# Altium schematic sheet Weatstone bridges part II.SchDoc: Weatstone bridges part II
size A4; Revision: 1; SheetNumber: 5; SheetTotal: 5
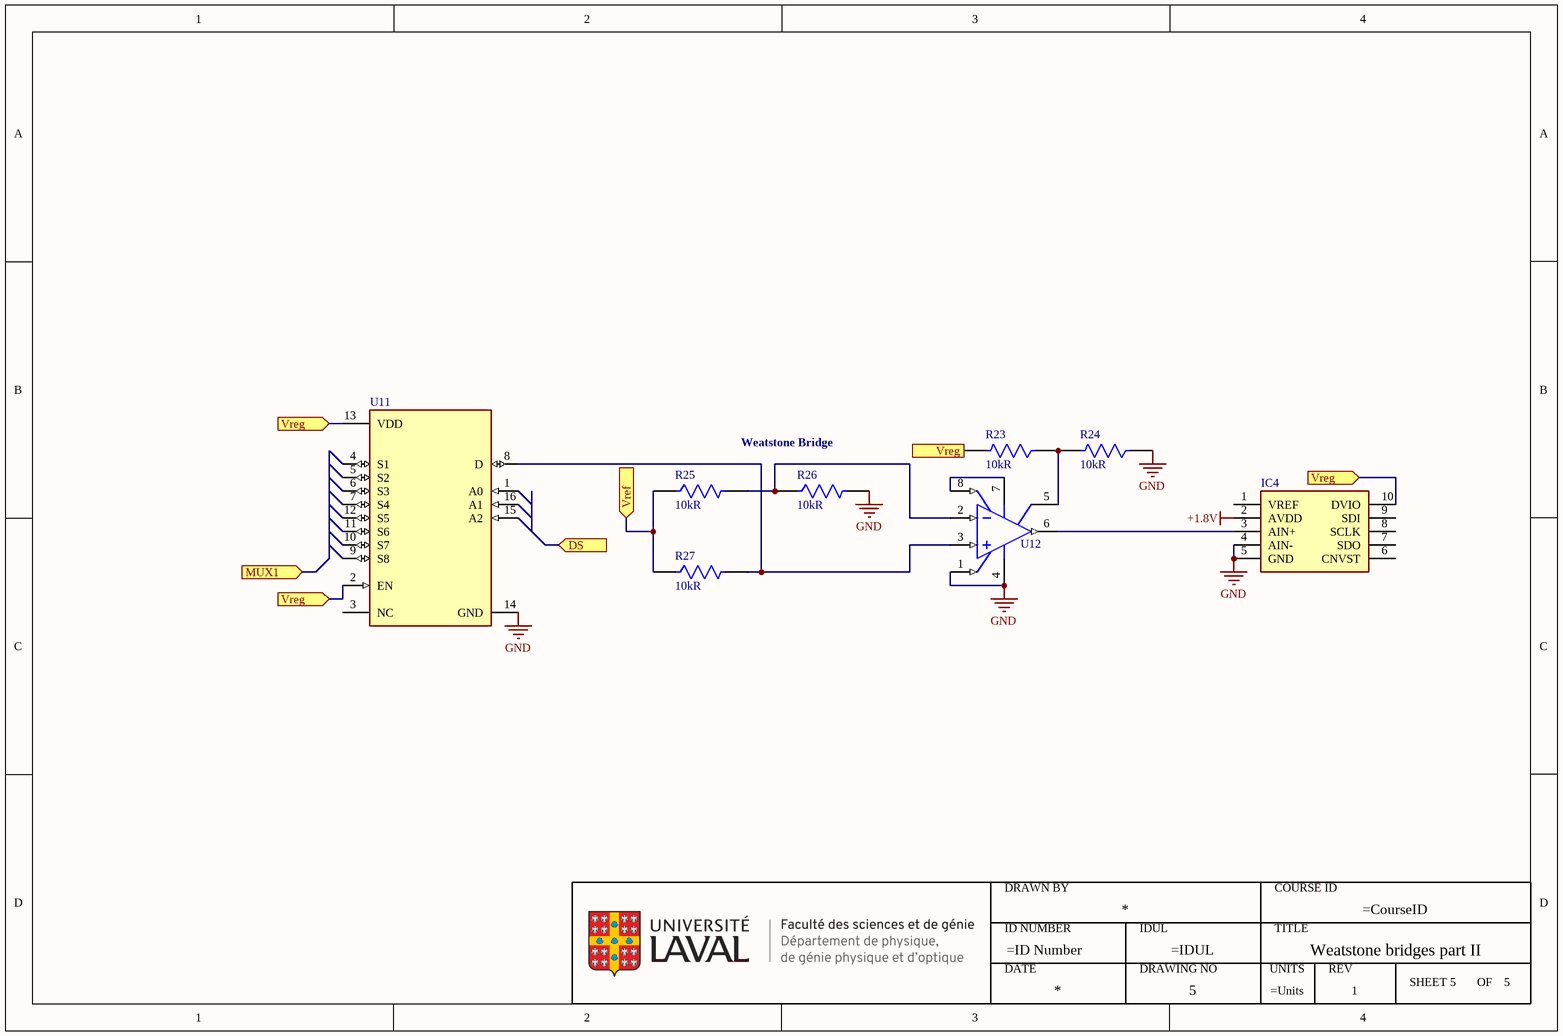
[diagram p0: Weatstone bridges part II.SchDoc]

## Parts
*4  ULaval FSG-DPGPO  (value not drawn)
IC4  MCP33141-10-E_MS  [SOP50P490X110-10N]  (value not drawn)
R23  value 10kR  [FP-RT0603-IPC_C]  (hidden comment: RT0603BRD0710KL)
R24  value 10kR  [FP-RT0603-IPC_C]  (hidden comment: RT0603BRD0710KL)
R25  value 10kR  [FP-RT0603-IPC_C]  (hidden comment: RT0603BRD0710KL)
R26  value 10kR  [FP-RT0603-IPC_C]  (hidden comment: RT0603BRD0710KL)
R27  value 10kR  [FP-RT0603-IPC_C]  (hidden comment: RT0603BRD0710KL)
U11  TMUX1208PWR  [FP-PW0016A-IPC_B]  (value not drawn)
U12  MCP6N11-100E/SN  [SOIC-SN8_L]  (value not drawn)

## Ports
DS (in), MUX1 (in, see Thermistors[1A], Weatstone bridges part I[1A]), Vref (in), Vreg (in, see Power Supply Unit[3B], Processing interface[2B], Weatstone bridges part I[2A], Weatstone bridges part I[2B], Weatstone bridges part I[2C], Weatstone bridges part I[3A], Weatstone bridges part I[3B], Weatstone bridges part I[3C], Weatstone bridges part II[1B], Weatstone bridges part II[1C], Weatstone bridges part II[3B]), Vreg (in, see Power Supply Unit[3B], Processing interface[2B], Weatstone bridges part I[2A], Weatstone bridges part I[2B], Weatstone bridges part I[2C], Weatstone bridges part I[3A], Weatstone bridges part I[3B], Weatstone bridges part I[3C], Weatstone bridges part II[1B], Weatstone bridges part II[1C], Weatstone bridges part II[4B]), Vreg (in, see Power Supply Unit[3B], Processing interface[2B], Weatstone bridges part I[2A], Weatstone bridges part I[2B], Weatstone bridges part I[2C], Weatstone bridges part I[3A], Weatstone bridges part I[3B], Weatstone bridges part I[3C], Weatstone bridges part II[1B], Weatstone bridges part II[3B], Weatstone bridges part II[4B]), Vreg (in, see Power Supply Unit[3B], Processing interface[2B], Weatstone bridges part I[2A], Weatstone bridges part I[2B], Weatstone bridges part I[2C], Weatstone bridges part I[3A], Weatstone bridges part I[3B], Weatstone bridges part I[3C], Weatstone bridges part II[1C], Weatstone bridges part II[3B], Weatstone bridges part II[4B])

## Nets
+1.8V: IC4.2(AVDD)
GND: IC4.4(AIN-) IC4.5(GND) R24.1 R26.2 U11.14(GND) U12.1(VFG) U12.4(VSS)
Vref: R25.1 R27.1 ; port Vref
Vreg: IC4.10(DVIO) R23.2 U11.2(EN) U11.13(VDD) ; port Vreg
NetIC4_3: IC4.3(AIN+) U12.6(VOUT)
NetR23_1: R23.1 R24.2 U12.5(VREF)
NetR25_2: R25.2 R26.1 U12.2(VIM)
NetR27_2: R27.2 U11.8(D) U12.3(VIP)
NetU12_7: U12.7(VDD) U12.8(EN/~{CAL})

Not connected (* = marked no-connect by the designer): IC4 1(VREF) 6(CNVST) 7(SDO) 8(SCLK) 9(SDI); U11 1(A0) 3(NC) 4(S1) 5(S2) 6(S3) 7(S4) 9(S8) 10(S7) 11(S6) 12(S5) 15(A2) 16(A1)

## Notes on the sheet
- Weatstone Bridge
- (in symbol ULaval FSG-DPGPO) DRAWN BY; COURSE ID; ID NUMBER; IDUL; TITLE; DATE; DRAWING NO; UNITS; REV; SHEET; OF

## Library data of the parts
IC4 = MCP33141-10-E_MS: Integrated Circuit; Manufacturer_Name: Microchip; Manufacturer_Part_Number: MCP33141-10-E/MS; Datasheet Link: https://www.arrow.com/en/products/mcp33141-10-ems/microchip-technology; Height: 1.1mm; Mouser Part Number: 579-MCP33141-10-E/MS; Mouser Price/Stock: https://www.mouser.co.uk/ProductDetail/Microchip-Technology/MCP33141-10-E-MS?qs=T3oQrply3y9rhBVvpVEw1Q%3D%3D; Arrow Part Number: MCP33141-10-E/MS; Arrow Price/Stock: https://www.arrow.com/en/products/mcp33141-10-ems/microchip-technology
R23-R27 = CMP-009-00178-1: Res High precision Thin Film 0603 10K Ohm 0.1% 1/10W ±25ppm/°C Molded SMD Paper T/R; Max Power Dissipation: 100mW; Working Voltage: 75V; RoHS Compliant: Yes; Power Rating: 100mW; Lead Free: Lead Free; Depth: 0.8mm; Case Code (Imperial): 0603; Max Operating Temperature: 155°C; Voltage Rating: 75V; Package Quantity: 5000; Packaging: Tape and Reel; Case/Package: 0603; Height: 0.022inch; Construction: Rectangular; Min Operating Temperature: -55°C; Termination: SMD/SMT; Features: Moisture Resistant; Number of Terminations: 2; Case Code (Metric): 1608; Technology: THIN FILM; Military Standard: Not; Length: 0.063inch; Voltage Rating (DC): 75V; Temperature Coefficient: 25ppm/°C; Weight: 7.1E-05oz; Width: 0.8mm; Series: RT; Resistor Type: Thin Film
U11 = CMP-015-00012-1: 5-V, 8: 1, 1-channel general-purpose analog multiplexer with 1.8-V input logic 16-TSSOP -40 to 125; RoHS Compliant: Yes
U12 = CMP-014-00010-1: MCP6N11 Series Single Channel 500 KHz 5.5 V Instrumentation Amplifier - SOIC-8; Bandwidth: 500kHz; Min Supply Voltage: 1.8V; Number of Elements: 2; Gain Bandwidth Product: 35MHz; Input Offset Voltage (Vos): 350uV; Number of Channels: 1; Nominal Supply Current: 800uA; Common Mode Rejection Ratio: 86dB; Slew Rate: 6V/µs; Max Supply Voltage: 5.5V; Slew Rate-Nom: 9V/µs; Input Bias Current: 10pA; Mounting Technology: Surface Mount; Package Quantity: 100; Pins: 8; Width: 3.9mm; Length: 4.9mm; Case/Package: SOIC; Min Operating Temperature: -40°C; Radiation Hardening: No; RoHS Compliant: Yes; Unity Gain Bandwidth Product: 35MHz; Lead Free: Lead Free; Number of Amplifiers: 1; Max Operating Temperature: 125°C; Height: 1.25mm; Packaging: Rail/Tube; Input Offset Voltage-Max: 350uV; Reach SVHC Compliant: Yes; Supply Current: 800uA; Max Supply Current: 800uA; Power Supply Rejection Ratio (PSRR): 86dB; Number of Circuits: 1